# Altium schematic sheet 原理图.SchDoc
size A4
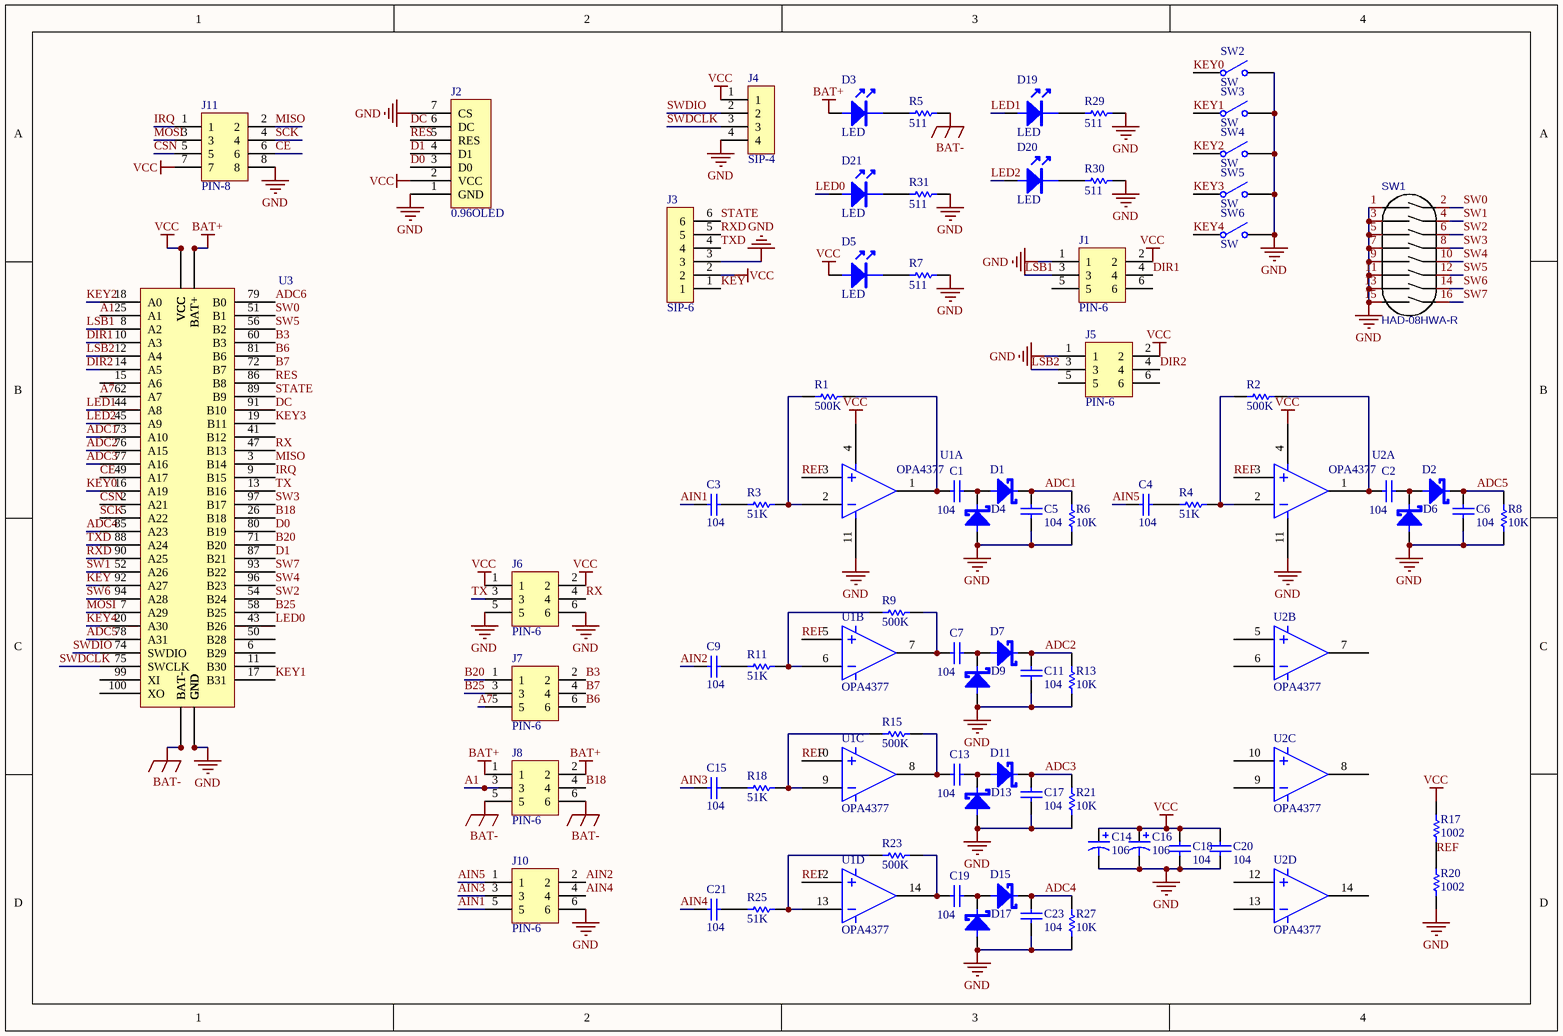
[diagram p0: 原理图.SchDoc]

## Parts
C1  104  [C0603]
C2  104  [C0603]
C3  104  [C0603]
C4  104  [C0603]
C5  104  [C0603]
C6  104  [C0603]
C7  104  [C0603]
C9  104  [C0603]
C11  104  [C0603]
C13  104  [C0603]
C14  106  [3216-ce]
C15  104  [C0603]
C16  106  [3216-ce]
C17  104  [C0603]
C18  104  [C0603]
C19  104  [C0603]
C20  104  [C0603]
C21  104  [C0603]
C23  104  [C0603]
D1  肖特基  [SOD-523]  (value not drawn)
D2  肖特基  [SOD-523]  (value not drawn)
D3  LED  [LED 0603G]
D4  肖特基  [SOD-523]  (value not drawn)
D5  LED  [LED 0603G]
D6  肖特基  [SOD-523]  (value not drawn)
D7  肖特基  [SOD-523]  (value not drawn)
D9  肖特基  [SOD-523]  (value not drawn)
D11  肖特基  [SOD-523]  (value not drawn)
D13  肖特基  [SOD-523]  (value not drawn)
D15  肖特基  [SOD-523]  (value not drawn)
D17  肖特基  [SOD-523]  (value not drawn)
D19  LED  [LED 0603G]
D20  LED  [LED 0603G]
D21  LED  [LED 0603G]
J1  PIN-6  [2.54简易牛角座6P]
J2  0.96OLED  [OLED 0.96]
J3  SIP-6  [2.54排针1X6]
J4  SIP-4  [XH2.54-4AB]
J5  PIN-6  [2.54简易牛角座6P]
J6  PIN-6  [P6smd]
J7  PIN-6  [P6smd]
J8  PIN-6  [P6smd]
J10  PIN-6  [P6smd]
J11  PIN-8  [2.54排针2X4]
R1  500K  [R0603]
R2  500K  [R0603]
R3  51K  [R0603]
R4  51K  [R0603]
R5  511  [R0603]
R6  10K  [R0603]
R7  511  [R0603]
R8  10K  [R0603]
R9  500K  [R0603]
R11  51K  [R0603]
R13  10K  [R0603]
R15  500K  [R0603]
R17  1002  [R0603]
R18  51K  [R0603]
R20  1002  [R0603]
R21  10K  [R0603]
R23  500K  [R0603]
R25  51K  [R0603]
R27  10K  [R0603]
R29  511  [R0603]
R30  511  [R0603]
R31  511  [R0603]
SW1  HAD-08HWA-R  [拨码MCEMR-08-T]
SW2  SW  [SWT6*3]
SW3  SW  [SWT6*3]
SW4  SW  [SWT6*3]
SW5  SW  [SWT6*3]
SW6  SW  [SWT6*3]
U1  OPA4377  [TSSOP-14]  (parts A,B,C,D of 4)
U2  OPA4377  [TSSOP-14]  (parts A,B,C,D of 4)
U3  主控&驱动  [核心]  (value not drawn)

## Nets
BAT+: D3.A J8.1 J8.2 U3.33(BAT+) U3.34(BAT+) U3.35(BAT+)
BAT-: J8.5 J8.6 R5.1 U3.37(BAT-) U3.38(BAT-) U3.39(BAT-) U3.40(BAT-)
GND: C5.1 C6.1 C11.1 C14.2 C16.2 C17.1 C18.1 C20.1 C23.1 D4.1(A) D6.1(A) D9.1(A) D13.1(A) D17.1(A) J1.1 J2.1(GND) J2.7(CS) J3.3 J4.4 J5.1 J6.5 J6.6 J10.6 J11.8 R6.2 R7.1 R8.2 R13.2 R20.1 R21.2 R27.2 R29.1 R30.1 R31.1 SW1.1 SW1.3 SW1.5 SW1.7 SW1.9 SW1.11 SW1.13 SW1.15 SW2.2(NO) SW3.2(NO) SW4.2(NO) SW5.2(NO) SW6.2(NO) U1.11 U2.11 U3.4(GND) U3.21(GND) U3.22(GND) U3.24(GND) U3.28(GND) U3.30(GND) U3.32(GND) U3.36(GND) U3.42(GND) U3.46(GND) U3.48(GND) U3.53(GND) U3.55(GND) U3.57(GND) U3.59(GND) U3.61(GND) U3.63(GND) U3.64(GND) U3.66(GND) U3.68(GND) U3.69(GND) U3.70(GND) U3.84(GND) U3.98(GND)
VCC: C14.1 C16.1 C18.2 C20.2 D5.A J1.2 J2.2(VCC) J3.2 J4.1 J5.2 J6.1 J6.2 J11.7 R17.2 U1.4 U2.4 U3.1(VCC) U3.23(VCC) U3.27(VCC) U3.29(VCC) U3.31(VCC) U3.65(VCC) U3.67(VCC) U3.82(VCC) U3.83(VCC) U3.95(VCC)
A1: J8.3 U3.25(A1)
A7: J7.5 U3.62(A7)
ADC1: C5.2 D1.2(K) R6.1 U3.73(A10)
ADC2: C11.2 D7.2(K) R13.1 U3.76(A15)
ADC3: C17.2 D11.2(K) R21.1 U3.77(A16)
ADC4: C23.2 D15.2(K) R27.1 U3.85(A23)
ADC5: C6.2 D2.2(K) R8.1 U3.78(A31)
ADC6: U3.79(B0)
AIN1: C3.1 J10.5
AIN2: C9.1 J10.2
AIN3: C15.1 J10.3
AIN4: C21.1 J10.4
AIN5: C4.1 J10.1
B3: J7.2 U3.60(B3)
B6: J7.6 U3.81(B6)
B7: J7.4 U3.72(B7)
B18: J8.4 U3.26(B18)
B20: J7.1 U3.71(B20)
B25: J7.3 U3.58(B25)
CE: J11.6 U3.49(A17)
CSN: J11.5 U3.2(A21)
D0: J2.3(D0) U3.80(B19)
D1: J2.4(D1) U3.87(B21)
DC: J2.6(DC) U3.91(B10)
DIR1: J1.4 U3.10(A3)
DIR2: J5.4 U3.14(A5)
IRQ: J11.1 U3.9(B15)
KEY: J3.1 U3.92(A27)
KEY0: SW2.1(COMMON) U3.16(A19)
KEY1: SW3.1(COMMON) U3.17(B31)
KEY2: SW4.1(COMMON) U3.18(A0)
KEY3: SW5.1(COMMON) U3.19(B11)
KEY4: SW6.1(COMMON) U3.20(A30)
LED0: D21.A U3.43(B26)
LED1: D19.A U3.44(A8)
LED2: D20.A U3.45(A9)
LSB1: J1.3 U3.8(A2)
LSB2: J5.3 U3.12(A4)
MISO: J11.2 U3.3(B14)
MOSI: J11.3 U3.7(A29)
REF: R17.1 R20.2 U1.3 U1.5 U1.10 U1.12 U2.3
RES: J2.5(RES) U3.86(B8)
RX: J6.4 U3.47(B13)
RXD: J3.5 U3.90(A25)
SCK: J11.4 U3.5(A22)
STATE: J3.6 U3.89(B9)
SW0: SW1.2 U3.51(B1)
SW1: SW1.4 U3.52(A26)
SW2: SW1.6 U3.54(B24)
SW3: SW1.8 U3.97(B17)
SW4: SW1.10 U3.96(B23)
SW5: SW1.12 U3.56(B2)
SW6: SW1.14 U3.94(A28)
SW7: SW1.16 U3.93(B22)
SWDCLK: J4.3 U3.75(SWCLK)
SWDIO: J4.2 U3.74(SWDIO)
TX: J6.3 U3.13(B16)
TXD: J3.4 U3.88(A24)
NetC1_1: C1.1 R1.1 U1.1
NetC1_2: C1.2 D1.1(A) D4.2(K)
NetC2_1: C2.1 R2.1 U2.1
NetC2_2: C2.2 D2.1(A) D6.2(K)
NetC3_2: C3.2 R3.2
NetC4_2: C4.2 R4.2
NetC7_1: C7.1 R9.1 U1.7
NetC7_2: C7.2 D7.1(A) D9.2(K)
NetC9_2: C9.2 R11.2
NetC13_1: C13.1 R15.1 U1.8
NetC13_2: C13.2 D11.1(A) D13.2(K)
NetC15_2: C15.2 R18.2
NetC19_1: C19.1 R23.1 U1.14
NetC19_2: C19.2 D15.1(A) D17.2(K)
NetC21_2: C21.2 R25.2
NetD3_K: D3.K R5.2
NetD5_K: D5.K R7.2
NetD19_K: D19.K R29.2
NetD20_K: D20.K R30.2
NetD21_K: D21.K R31.2
NetR1_2: R1.2 R3.1 U1.2
NetR2_2: R2.2 R4.1 U2.2
NetR9_2: R9.2 R11.1 U1.6
NetR15_2: R15.2 R18.1 U1.9
NetR23_2: R23.2 R25.1 U1.13

Not connected (* = marked no-connect by the designer): J1 5 6; J5 5 6; U2 5 6 7 8 9 10 12 13 14; U3 6(B29) 11(B30) 15(A6) 41(B12) 50(B28) 99(XI) 100(XO)

## Notes on the sheet
- Title
- Size:
- Date:
- A4
- Number:
- Time:
- Revision:
- Sheet
- of
- File:

## Library data of the parts
C1-C7 C9 C11 C13 C15 C17-C21 C23 = 电容: Capacitor; Value: 22pF; Published: 8-Jun-2000; LatestRevisionDate: 17-Jul-2002; LatestRevisionNote: Re-released for DXP Platform.; PackageReference: RAD-0.3; Publisher: Altium Limited; PackageDescription: Radial Cap, Thru-Hole; 2 Leads; 0.3 in Pin Spacing
C14 C16 = 电解电容: Polarized Capacitor (Axial); Value: 100pF; Published: 8-Jun-2000; LatestRevisionDate: 17-Jul-2002; LatestRevisionNote: Re-released for DXP Platform.; PackageReference: POLAR0.8; Publisher: Altium Limited; PackageDescription: Polarized Capacitor; 2 Leads
D1 D2 D4 D6 D7 D9 D11 D13 D15 D17 = 肖特基: Schottky Diode
J2 = OLED_SPI
R1-R9 R11 R13 R15 R17 R18 R20 R21 R23 R25 R27 R29-R31 = 电阻: Resistor; Value: 150R; Published: 8-Jun-2000; LatestRevisionDate: 17-Jul-2002; LatestRevisionNote: Re-released for DXP Platform.; PackageReference: AXIAL-0.3; Publisher: Altium Limited; PackageDescription: Axial Device, Thru-Hole; 2 Leads; 0.3 in Pin Spacing
SW1 = 8位拨码: BOM_Manufacturer: ReliaPro; BOM_Supplier: LCSC; BOM_Manufacturer Part: HAD-08HWA-R; image: //image.lceda.cn/szlcsc/C4682.jpg; BOM_Supplier Part: C4682; spicePre: D; spiceSymbolName: HAD-08HWA-R
SW2-SW6 = Switch: Single-Pole, Single-Throw Switch
U1 U2 = 4运放
U3 = 核心